# EAGLE schematic MeterMaidV2 (EAGLE 9.5.2)
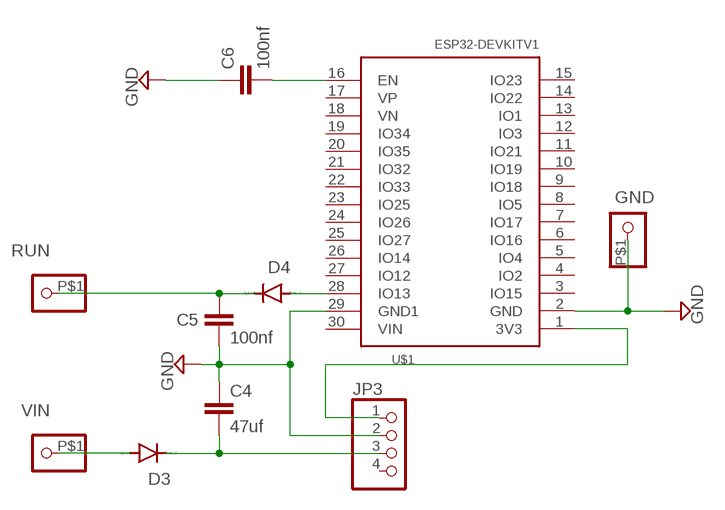
[diagram p0: schematic, sheet 1]

## Parts
C4  47uf  C-EU025-050X050  [C025-050X050]
C5  100nf  C-EU025-050X050  [C025-050X050]
C6  100nf  C-EU025-050X050  [C025-050X050]
D3  1N4004  [DO41-10]
D4  1N4004  [DO41-10]
GND  PINHD-1X11X02  [1X01LP]
JP3  PINHD-1X4  [1X04]
RUN  PINHD-1X11X02  [1X01LP]
U$1  ESP32DEVKITV1ESP32-DEVKITV2  [ESP32-DEVKITV2]
VIN  PINHD-1X11X02  [1X01LP]

## Nets
GND: C4.1 C5.2 C6.1 GND.P$1 JP3.2 U$1.2(GND) U$1.29(GND1)
N$1: JP3.1 U$1.1(3V3)
N$2: C4.2 D3.C JP3.3
N$3: D4.A U$1.28(IO13)
N$4: C5.1 D4.C RUN.P$1
N$5: C6.2 U$1.16(EN)
N$6: D3.A VIN.P$1
Unconnected: JP3.4 U$1.3(IO15) U$1.4(IO2) U$1.5(IO4) U$1.6(IO16) U$1.7(IO17) U$1.8(IO5) U$1.9(IO18) U$1.10(IO19) U$1.11(IO21) U$1.12(IO3) U$1.13(IO1) U$1.14(IO22) U$1.15(IO23) U$1.17(VP) U$1.18(VN) U$1.19(IO34) U$1.20(IO35) U$1.21(IO32) U$1.22(IO33) U$1.23(IO25) U$1.24(IO26) U$1.25(IO27) U$1.26(IO14) U$1.27(IO12) U$1.30(VIN)

## Library data of the parts
C4-C6 = rcl:C-EU: CAPACITOR, European symbol; SPICEPREFIX: C
D3 D4 = Sam:1N4004: DIODE general purpose rectifier, 1 A
GND RUN VIN = Sam:PINHD-1X1: PIN HEADER
JP3 = Sam:PINHD-1X4: PIN HEADER
U$1 = ESP32-DEVKITV1MOD:ESP32DEVKITV1